# EAGLE design TeensyROM (EAGLE 7.7.0)
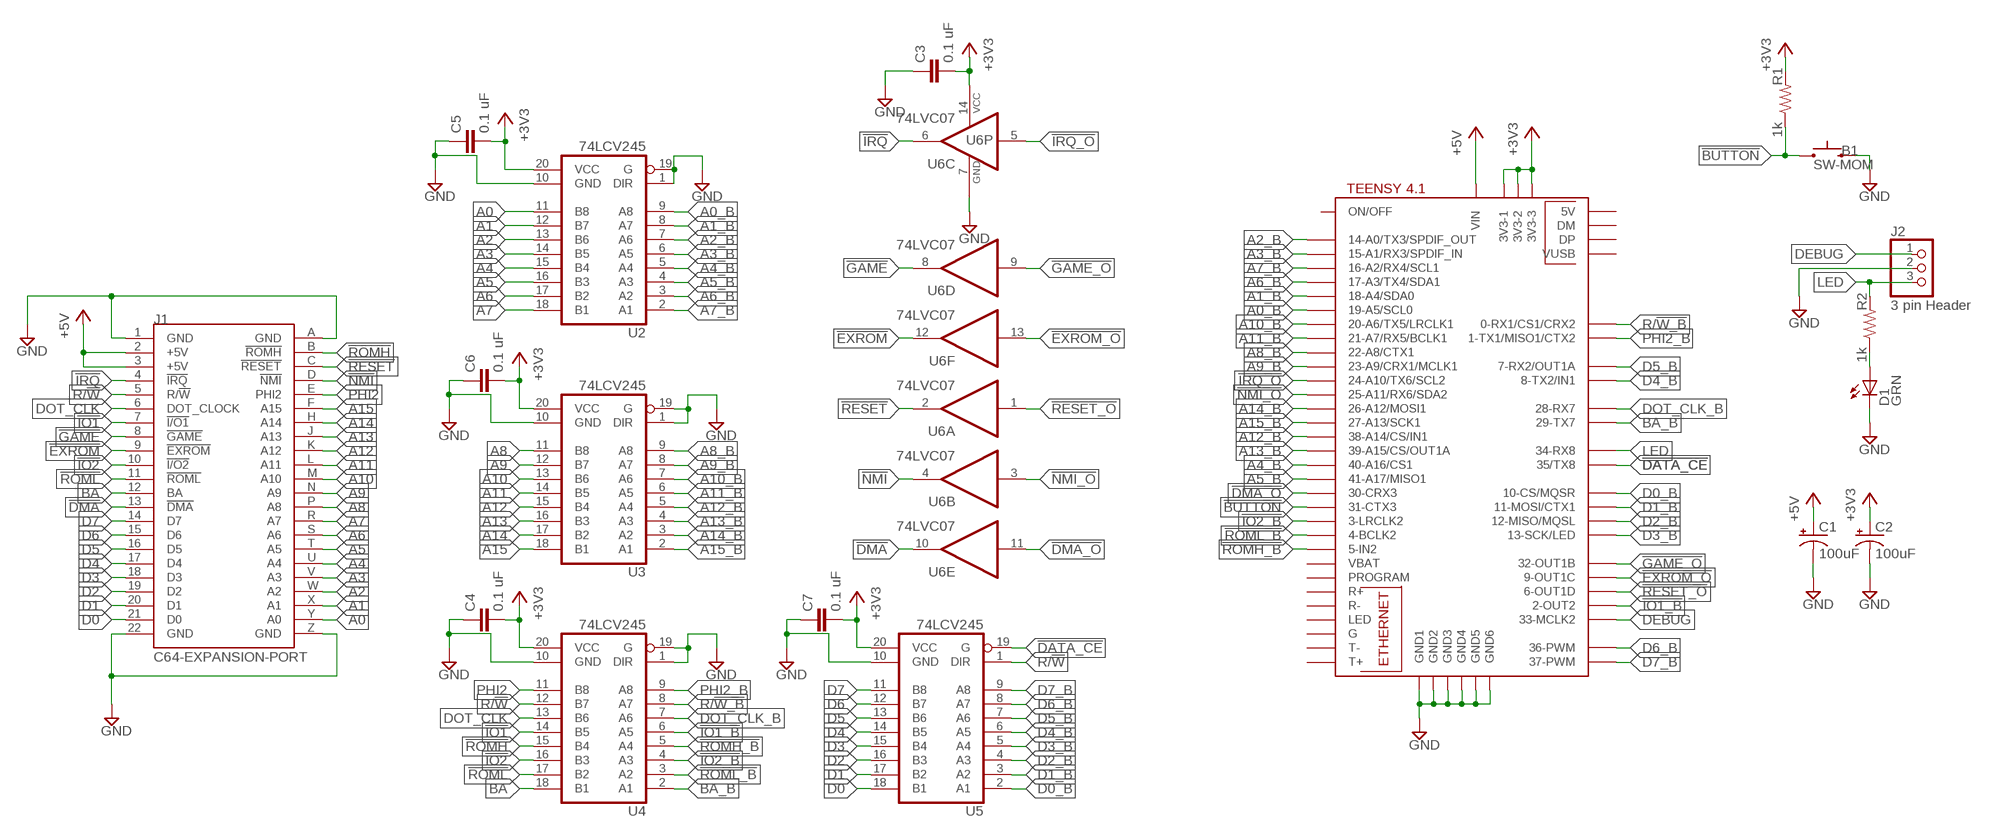
[diagram p0: schematic, sheet 1]

## Parts
B1  SW-MOM  SWITCH-MOMENTARY-2PTH  [TACTILE-PTH]
C1  100uF  CPOL-USE2.5-6  [E2,5-6]
C2  100uF  CPOL-USE2.5-6  [E2,5-6]
C3  0.1 uF  CAP-0805-0.1UF-50V  [0805]
C4  0.1 uF  CAP-0805-0.1UF-50V  [0805]
C5  0.1 uF  CAP-0805-0.1UF-50V  [0805]
C6  0.1 uF  CAP-0805-0.1UF-50V  [0805]
C7  0.1 uF  CAP-0805-0.1UF-50V  [0805]
D1  GRN  LED-3MM-GRN  [LED-3MM-PTH]
J1  C64-EXPANSION-PORT  C64-EXPANSIONPNARROW  [EXPANSIO_SQ]
J2  3 pin Header  PINHD-1X3  [1X03]
R1  1k  R-US_R0805  [R0805]
R2  1k  R-US_R0805  [R0805]
U1  TEENSY41  [TEENSY41]
U2  74LCV245  74LS245DW  [SO20W]
U3  74LCV245  74LS245DW  [SO20W]
U4  74LCV245  74LS245DW  [SO20W]
U5  74LCV245  74LS245DW  [SO20W]
U6  74LVC07  74LS07D  [SO14]

## Nets
!BUTTON: B1.1 R1.1 U1.31-CTX3
!DATA_CE: U1.35-TX8(35/TX8) U5.19(G)
!DMA: J1.13(!DMA) U6.10(E:O)
!DMA_O: U1.30-CRX3 U6.11(E:I)
!EXROM: J1.9(!EXROM) U6.12(F:O)
!EXROM_O: U1.9-OUT1C U6.13(F:I)
!GAME: J1.8(!GAME) U6.8(D:O)
!GAME_O: U1.32-OUT1B U6.9(D:I)
!IO1: J1.7(!I/O1) U4.14(B5)
!IO1_B: U1.2-OUT2 U4.6(A5)
!IO2: J1.10(!I/O2) U4.16(B3)
!IO2_B: U1.3-LRCLK2 U4.4(A3)
!IRQ: J1.4(!IRQ) U6.6(C:O)
!IRQ_O: U1.24-A10/TX6/SCL2 U6.5(C:I)
!NMI: J1.D(!NMI) U6.4(B:O)
!NMI_O: U1.25-A11/RX6/SDA2 U6.3(B:I)
!RESET: J1.C(!RESET) U6.2(A:O)
!RESET_O: U1.6-OUT1D U6.1(A:I)
!ROMH: J1.B(!ROMH) U4.15(B4)
!ROMH_B: U1.5-IN2 U4.5(A4)
!ROML: J1.11(!ROML) U4.17(B2)
!ROML_B: U1.4-BCLK2 U4.3(A2)
+3V3: C2.+ C3.2 C4.2 C5.2 C6.2 C7.2 R1.2 U1.3V3-1 U1.3V3-2 U1.3V3-3 U2.20(VCC) U3.20(VCC) U4.20(VCC) U5.20(VCC) U6.14(P:VCC)
+5V: C1.+ J1.2(+5V) J1.3(+5V) U1.VIN
A0: J1.Y(A0) U2.11(B8)
A0_B: U1.19-A5/SCL0 U2.9(A8)
A1: J1.X(A1) U2.12(B7)
A1_B: U1.18-A4/SDA0 U2.8(A7)
A2: J1.W(A2) U2.13(B6)
A2_B: U1.14-A0/TX3/SPDIF_OUT U2.7(A6)
A3: J1.V(A3) U2.14(B5)
A3_B: U1.15-A1/RX3/SPDIF_IN U2.6(A5)
A4: J1.U(A4) U2.15(B4)
A4_B: U1.40-A16/CS1 U2.5(A4)
A5: J1.T(A5) U2.16(B3)
A5_B: U1.41-A17/MISO1 U2.4(A3)
A6: J1.S(A6) U2.17(B2)
A6_B: U1.17-A3/TX4/SDA1 U2.3(A2)
A7: J1.R(A7) U2.18(B1)
A7_B: U1.16-A2/RX4/SCL1 U2.2(A1)
A8: J1.P(A8) U3.11(B8)
A8_B: U1.22-A8/CTX1 U3.9(A8)
A9: J1.N(A9) U3.12(B7)
A9_B: U1.23-A9/CRX1/MCLK1 U3.8(A7)
A10: J1.M(A10) U3.13(B6)
A10_B: U1.20-A6/TX5/LRCLK1 U3.7(A6)
A11: J1.L(A11) U3.14(B5)
A11_B: U1.21-A7/RX5/BCLK1 U3.6(A5)
A12: J1.K(A12) U3.15(B4)
A12_B: U1.38-A14/CS/IN1 U3.5(A4)
A13: J1.J(A13) U3.16(B3)
A13_B: U1.39-A15/CS/OUT1A U3.4(A3)
A14: J1.H(A14) U3.17(B2)
A14_B: U1.26-A12/MOSI1 U3.3(A2)
A15: J1.F(A15) U3.18(B1)
A15_B: U1.27-A13/SCK1 U3.2(A1)
BA: J1.12(BA) U4.18(B1)
BA_B: U1.29-TX7 U4.2(A1)
D0: J1.21(D0) U5.18(B1)
D0_B: U1.10-CS\MQSR(10-CS/MQSR) U5.2(A1)
D1: J1.20(D1) U5.17(B2)
D1_B: U1.11-MOSI/CTX1 U5.3(A2)
D2: J1.19(D2) U5.16(B3)
D2_B: U1.12-MISO/MQSL U5.4(A3)
D3: J1.18(D3) U5.15(B4)
D3_B: U1.13-SCK/LED U5.5(A4)
D4: J1.17(D4) U5.14(B5)
D4_B: U1.8-TX2/IN1 U5.6(A5)
D5: J1.16(D5) U5.13(B6)
D5_B: U1.7-RX2/OUT1A U5.7(A6)
D6: J1.15(D6) U5.12(B7)
D6_B: U1.36-PWM U5.8(A7)
D7: J1.14(D7) U5.11(B8)
D7_B: U1.37-PWM U5.9(A8)
DEBUG: J2.1 U1.33-MCLK2
DOT_CLK: J1.6(DOT_CLOCK) U4.13(B6)
DOT_CLK_B: U1.28-RX7 U4.7(A6)
GND: B1.3 C1.- C2.- C3.1 C4.1 C5.1 C6.1 C7.1 D1.K(C) J1.1(GND) J1.22(GND) J1.A(GND) J1.Z(GND) J2.2 U1.GND1 U1.GND2 U1.GND3 U1.GND4 U1.GND5 U1.GND6 U2.1(DIR) U2.10(GND) U2.19(G) U3.1(DIR) U3.10(GND) U3.19(G) U4.1(DIR) U4.10(GND) U4.19(G) U5.10(GND) U6.7(P:GND)
LED: J2.3 R2.2 U1.34-RX8
N$1: D1.A R2.1
PHI2: J1.E(PHI2) U4.11(B8)
PHI2_B: U1.1-TX1/MISO1/CTX2 U4.9(A8)
R/!W: J1.5(R/!W) U4.12(B7) U5.1(DIR)
R/!W_B: U1.0-RX1/CS1/CRX2 U4.8(A7)
Unconnected: U1.+5V(5V) U1.DM U1.DP U1.G U1.LED U1.ON/OFF U1.PROGRAM U1.R+ U1.R- U1.T+ U1.T- U1.VBAT U1.VUSB

## Library data of the parts
B1 = AudioLooper:SWITCH-MOMENTARY-2
C1 C2 = rcl:CPOL-US: POLARIZED CAPACITOR, American symbol
C3-C7 = cap:CAP-0805-: Cap, 0805; DIGIKEY: 478-10836-2-ND; MANUF1: AVX Corporation; MANUF2: Matsushita; MPN1: 08055C104KAT4A; MPN2: NMC0805X7R104K50TRPF
D1 = Dolphin v3.20:LED-3MM-: LED 3.1MM PTH; DIGIKEY: 516-1293-ND; MANUF1: Broadcom Limited; MPN1: HLMP-1503
J1 = TeensyROM:C64-EXPANSIONP
J2 = TeensyROM:PINHD-1X3: PIN HEADER
R1 R2 = resistor:R-US_: RESISTOR, American symbol
U1 = TeensyROM:TEENSY41
U2-U5 = TeensyROM:74*245: Octal BUS TRANSCEIVER, 3-state
U6 = TeensyROM:74*07: Hex BUFFER, open collector high-voltage output

## Net classes
1 vcc: width 0.254 mm

## Board
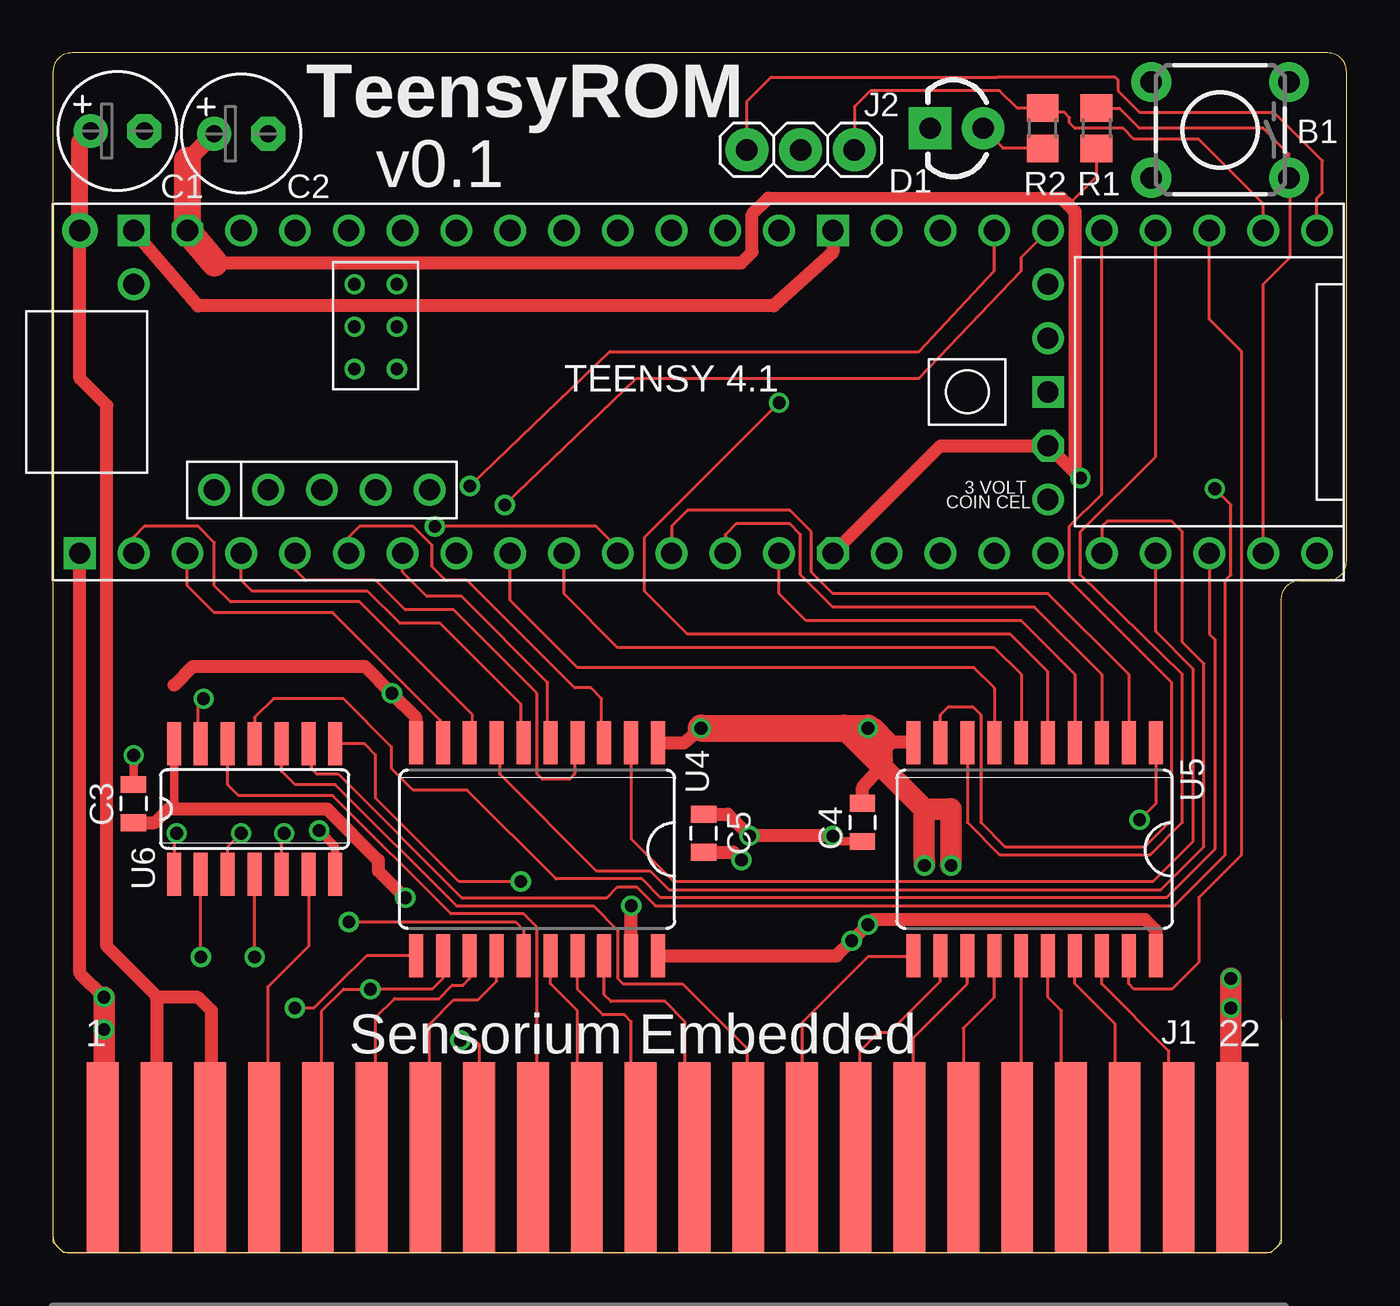
[diagram p1: board, top side]
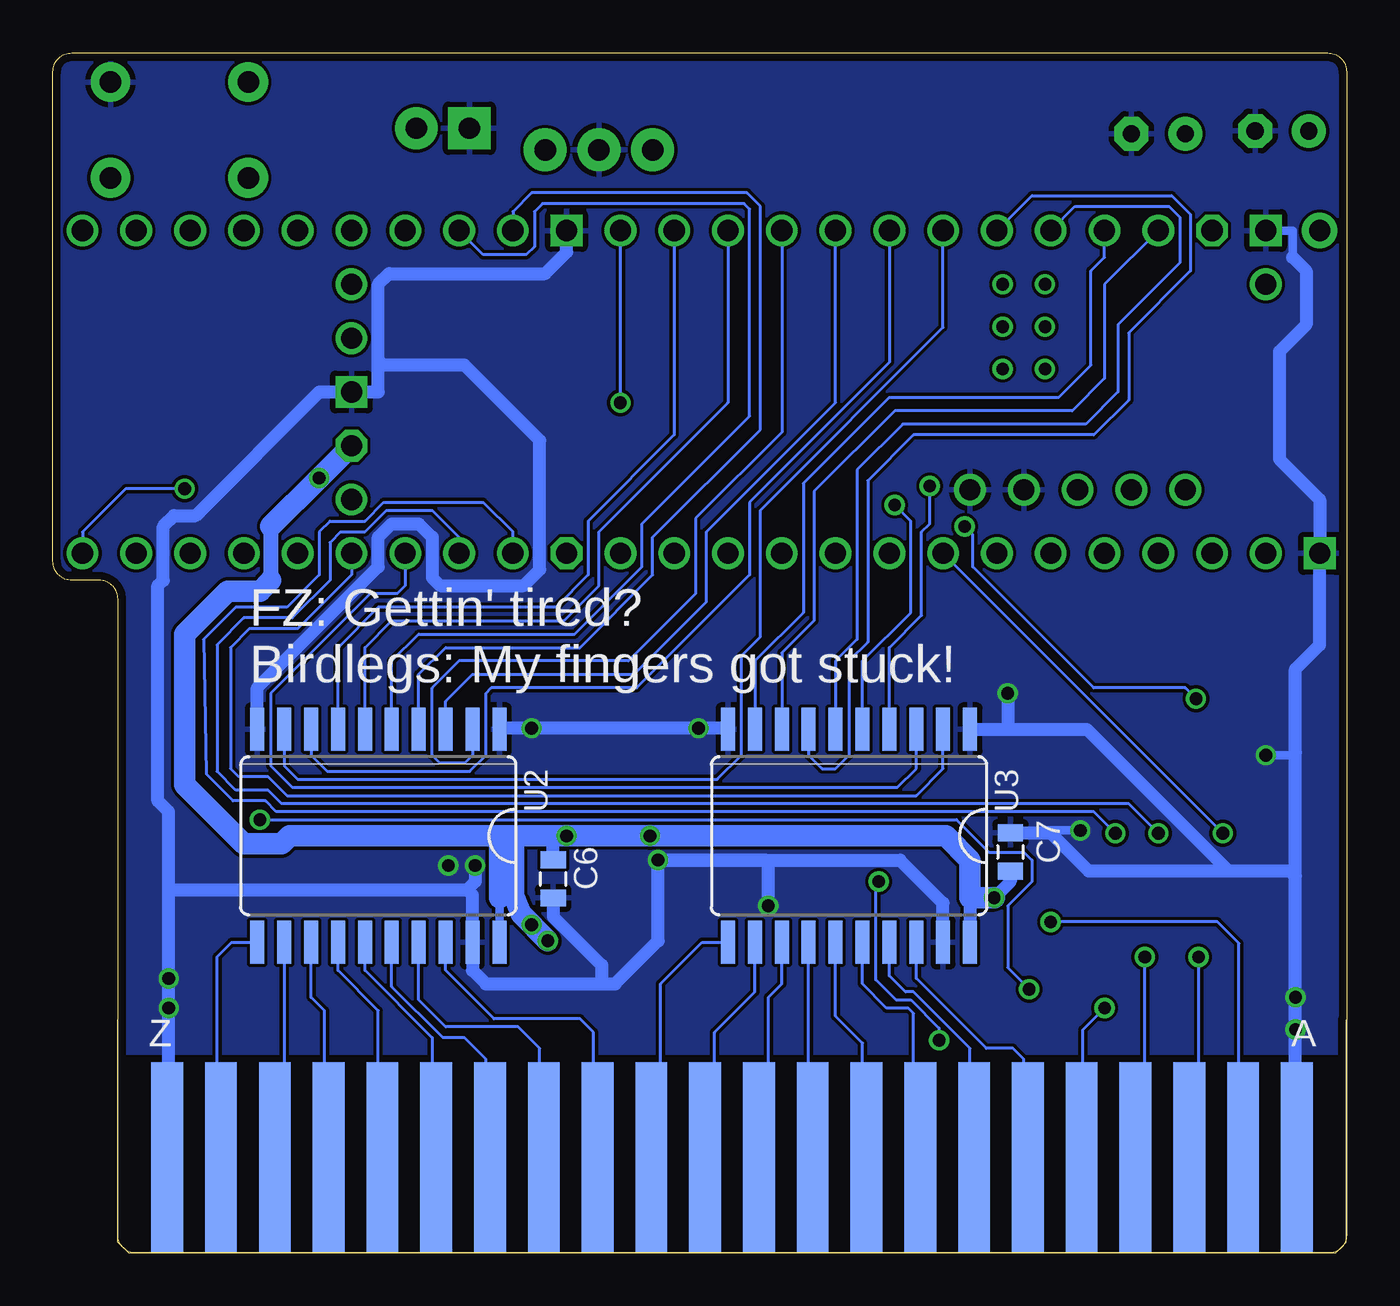
[diagram p2: board, bottom side, seen from below]

Size 61.09 x 56.64 mm. Coordinates in mm from the lower left corner, seen from the top.
Outline: 60.2,56.64 0.89,56.64 arc90 0,55.75 0,0.83 arc90 0.83,0 57.19,0 arc90 58.01,0.83 58.01,30.86 arc-90 58.9,31.75 60.2,31.75 arc90 61.09,32.64 61.09,55.75 arc90 60.2,56.64
Copper layers (1*16): Top 0.0356mm / dielectric 1.5011mm / Bottom 0.0356mm
Design rules "oshpark-2layer *": minimum track width 6mil, minimum drill 13mil, track to track 6mil, track to pad 6mil, pad to pad 6mil, via to via 6mil, smd to smd 6mil, copper to edge 15mil, drill to drill 6mil, minimum pad ring 7mil, minimum via ring 7mil, stop-mask expansion 2.5mil, vias tented up to drill 24mil, thermal gap 10mil

### Footprints (pad centres in the part's own frame; a part is rotated, then mirrored left to right if it is on the bottom)
TACTILE-PTH = drill 1.016 pad 1.88: 1 -3.251,2.261; 2 3.251,2.261; 3 -3.251,-2.261; 4 3.251,-2.261
E2,5-6 = drill 0.813 pad 1.6: + -1.27,0 | drill 0.813 pad 1.6 octagon: - 1.27,0
0805 = smd 0.8 x 1.2: 1 -0.9,0; 2 0.9,0
LED-3MM-PTH = drill 1 pad 2: A -1.25,0 | drill 1 pad 2 square: K 1.25,0
EXPANSIO_SQ = smd 1.5 x 9: 1 26.67,-4.5; 2 24.13,-4.5; 3 21.59,-4.5; 4 19.05,-4.5; 5 16.51,-4.5; 6 13.97,-4.5; 7 11.43,-4.5; 8 8.89,-4.5; 9 6.35,-4.5; 10 3.81,-4.5; 11 1.27,-4.5; 12 -1.27,-4.5; 13 -3.81,-4.5; 14 -6.35,-4.5; 15 -8.89,-4.5; 16 -11.43,-4.5; 17 -13.97,-4.5; 18 -16.51,-4.5; 19 -19.05,-4.5; 20 -21.59,-4.5; 21 -24.13,-4.5; 22 -26.67,-4.5 | smd 1.5 x 9 bottom: A 26.67,-4.5; B 24.13,-4.5; C 21.59,-4.5; D 19.05,-4.5; E 16.51,-4.5; F 13.97,-4.5; H 11.43,-4.5; J 8.89,-4.5; K 6.35,-4.5; L 3.81,-4.5; M 1.27,-4.5; N -1.27,-4.5; P -3.81,-4.5; R -6.35,-4.5; S -8.89,-4.5; T -11.43,-4.5; U -13.97,-4.5; V -16.51,-4.5; W -19.05,-4.5; X -21.59,-4.5; Y -24.13,-4.5; Z -26.67,-4.5
1X03 = drill 1.016 pad 2.032: 1 -2.54,0; 2 0,0; 3 2.54,0
R0805 = smd 1.3 x 1.5: 1 -0.95,0; 2 0.95,0
TEENSY41 = drill 1: 0-RX1/CS1/CRX2 -27.94,-7.62; 1-TX1/MISO1/CTX2 -25.4,-7.62; 2-OUT2 -22.86,-7.62; 3-LRCLK2 -20.32,-7.62; 4-BCLK2 -17.78,-7.62; 5-IN2 -15.24,-7.62; 6-OUT1D -12.7,-7.62; 7-RX2/OUT1A -10.16,-7.62; 8-TX2/IN1 -7.62,-7.62; 9-OUT1C -5.08,-7.62; 10-CS\MQSR -2.54,-7.62; 11-MOSI/CTX1 0,-7.62; 12-MISO/MQSL 2.54,-7.62; 13-SCK/LED 2.54,7.62; 14-A0/TX3/SPDIF_OUT 0,7.62; 15-A1/RX3/SPDIF_IN -2.54,7.62; 16-A2/RX4/SCL1 -5.08,7.62; 17-A3/TX4/SDA1 -7.62,7.62; 18-A4/SDA0 -10.16,7.62; 19-A5/SCL0 -12.7,7.62; 20-A6/TX5/LRCLK1 -15.24,7.62; 21-A7/RX5/BCLK1 -17.78,7.62; 22-A8/CTX1 -20.32,7.62; 23-A9/CRX1/MCLK1 -22.86,7.62; 24-A10/TX6/SCL2 7.62,-7.62; 25-A11/RX6/SDA2 10.16,-7.62; 26-A12/MOSI1 12.7,-7.62; 27-A13/SCK1 15.24,-7.62; 28-RX7 17.78,-7.62; 29-TX7 20.32,-7.62; 30-CRX3 22.86,-7.62; 31-CTX3 25.4,-7.62; 32-OUT1B 27.94,-7.62; 33-MCLK2 27.94,7.62; 34-RX8 25.4,7.62; 35-TX8 22.86,7.62; 36-PWM 20.32,7.62; 37-PWM 17.78,7.62; 38-A14/CS/IN1 15.24,7.62; 39-A15/CS/OUT1A 12.7,7.62; 40-A16/CS1 10.16,7.62; 41-A17/MISO1 7.62,7.62; +5V -24.13,-4.62; DM -21.59,-4.62; DP -19.05,-4.62; GND4 -16.51,-4.62; GND5 -13.97,-4.62; ON/OFF 15.24,5.08; PROGRAM 15.24,2.54; VBAT 15.24,-5.08; VUSB -27.94,5.08 | drill 1 octagon: 3V3-1 5.08,-7.62; 3V3-2 15.24,-2.54; 3V3-3 -25.4,7.62 | drill 0.6: G -15.51,3.08; LED -17.51,3.08; R+ -17.51,5.08; R- -15.51,5.08; T+ -15.51,1.08; T- -17.51,1.08 | drill 1 square: GND1 -30.48,-7.62; GND2 15.24,0; GND3 5.08,7.62; GND6 -27.94,7.62 | drill 1 pad 1.676: VIN -30.48,7.62
SO20W = smd 0.66 x 2.032: 1 -5.715,-5.029; 2 -4.445,-5.029; 3 -3.175,-5.029; 4 -1.905,-5.029; 5 -0.635,-5.029; 6 0.635,-5.029; 7 1.905,-5.029; 8 3.175,-5.029; 9 4.445,-5.029; 10 5.715,-5.029; 11 5.715,5.029; 12 4.445,5.029; 13 3.175,5.029; 14 1.905,5.029; 15 0.635,5.029; 16 -0.635,5.029; 17 -1.905,5.029; 18 -3.175,5.029; 19 -4.445,5.029; 20 -5.715,5.029
SO14 = smd 0.66 x 2.032: 1 -3.81,-3.073; 2 -2.54,-3.073; 3 -1.27,-3.073; 4 0,-3.073; 5 1.27,-3.073; 6 2.54,-3.073; 7 3.81,-3.073; 8 3.81,3.073; 9 2.54,3.073; 10 1.27,3.073; 11 0,3.073; 12 -1.27,3.073; 13 -2.54,3.073; 14 -3.81,3.073

### Placement (x,y rotation side)
B1  55.12,53.01 180 top
C1  3.05,52.96 0 top
C2  8.89,52.83 0 top
C3  3.81,21.21 270 top
C4  38.23,20.32 270 top
C5  30.73,19.81 90 top
C6  37.47,17.65 90 bottom
C7  15.88,18.92 270 bottom
D1  42.67,53.09 180 top
J1  29.02,0 180 top
J2  35.31,52.07 0 top
R1  49.28,53.09 270 top
R2  46.74,53.09 90 top
U1  31.75,40.64 0 top
U2  45.72,19.68 180 bottom
U3  23.5,19.68 180 bottom
U4  22.86,19.05 180 top
U5  46.35,19.05 180 top
U6  9.53,20.95 0 top

### Tracks (layer width: path | path; a pad name or v marks a point on that pad's centre or on a via)
!BUTTON
  Top 0.152: U1.31-CTX3 57.15,45.72 58.42,46.99 58.42,50.77 B1.1 58.37,51.87 57.15,53.09 51.31,53.09 50.36,54.04 R1.1
!DATA_CE
  Top 0.152: U1.35-TX8 54.61,44.07 56.13,42.55 56.13,18.8 54.1,16.76 54.1,13.72 52.83,12.45 51.05,12.45 50.8,12.7 U5.19
!DMA
  Top 0.152: J1.13 33.02,6.6 32.77,6.85 32.77,9.65 29.72,12.7 26.92,12.7 26.67,12.95 26.67,15.24 25.53,16.38 19.05,16.38 13.34,22.1 11.43,22.1 10.79,22.73 U6.10
!DMA_O
  Top 0.152: U1.30-CRX3 54.61,29.21 54.86,28.96 54.86,19.05 52.58,16.76 28.7,16.76 27.81,17.65 23.75,17.65 19.56,21.84 17.02,21.84 16,22.86 16,23.88 13.72,26.16 10.41,26.16 9.53,25.27 U6.11
!EXROM
  Top 0.152: J1.9 22.86,6.6 22.86,15.37 22.23,16 18.8,16 13.21,21.59 8.76,21.59 8.26,22.1 U6.12
!EXROM_O  (via drill 0.6)
  Top 0.152: 7.11,24.16 U6.13 6.86,24.16 6.86,25.91 v7.11,26.16 | U1.9-OUT1C 26.67,33.27 25.65,34.29 v18.03,34.29
  Bottom 0.152: v7.11,26.16 7.62,26.67 11.94,26.67 17.65,32.38 17.65,33.91 v18.03,34.29
!GAME  (via drill 0.6)
  Top 0.152: v19.24,10.03 19.94,10.03 20.13,9.84 J1.8 | v22.1,17.53 19.18,17.53 15.24,21.46 15.24,23.5 14.71,24.03 U6.8
  Bottom 0.152: v22.1,17.53 22.23,17.14 22.23,12.89 21.27,11.94 20.57,11.94 19.24,10.6 v19.24,10.03
!GAME_O  (via drill 0.6)
  Top 0.152: U6.9 12.19,23.9 12.19,22.86 12.45,22.61 13.46,22.61 19.3,16.76 26.16,16.76 26.67,17.27 27.56,17.27 28.45,16.38 52.96,16.38 55.37,18.8 55.37,31.75 55.63,32 55.63,35.31 v54.86,36.07
  Bottom 0.152: v54.86,36.07 57.66,36.07 59.69,34.04 U1.32-OUT1B
!IO1
  Top 0.152: J1.7 17.78,6.6 17.78,10.79 18.92,11.94 20.07,11.94 20.95,12.83 U4.14
!IO1_B
  Top 0.152: U4.6 22.1,24.21 22.1,25.91 18.29,29.72 16.38,29.72 14.86,31.24 9.4,31.24 8.89,31.75 U1.2-OUT2
!IO2
  Top 0.152: J1.10 24.77,6.85 24.77,11.43 23.5,12.7 U4.16
!IO2_B
  Top 0.152: U4.4 24.64,23.95 24.64,22.61 24.38,22.35 23.11,22.35 22.86,22.61 22.86,26.42 18.92,30.35 16.64,30.35 15.24,31.75 11.94,31.75 11.43,32.26 U1.3-LRCLK2
!IRQ
  Top 0.152: J1.4 10.16,6.6 10.16,12.57 12.06,14.48 U6.6
!IRQ_O  (via drill 0.6)
  Top 0.152: U6.5 10.79,19.68 v10.92,19.81
  Bottom 0.152: U1.24-A10/TX6/SCL2 39.37,34.04 40.77,35.43 45.47,35.43 46.35,34.54 48.01,34.54 48.51,34.04 48.51,32 50.04,30.48 52.45,30.48 53.98,28.96 53.85,22.61 52.58,21.34 51.05,21.34 50.55,20.83 11.94,20.83 v10.92,19.81
!NMI  (via drill 0.6)
  Top 0.152: v9.53,13.97 U6.4
  Bottom 0.152: J1.D 9.53,6.85 v9.53,13.97
!NMI_O  (via drill 0.6)
  Top 0.152: U6.3 8.26,19.18 v8.89,19.81
  Bottom 0.152: U1.25-A11/RX6/SDA2 41.91,33.78 43.18,35.05 45.34,35.05 46.35,34.04 47.5,34.04 48.01,33.53 48.01,31.75 49.78,29.97 52.07,29.97 53.34,28.7 53.34,22.73 52.45,21.84 50.93,21.84 50.29,21.21 10.29,21.21 v8.89,19.81
!RESET  (via drill 0.6)
  Top 0.152: v6.99,13.97 U6.2
  Bottom 0.152: J1.C 6.99,6.85 v6.99,13.97
!RESET_O  (via drill 0.6)
  Top 0.152: v5.84,19.81 5.71,19.68 U6.1
  Bottom 0.152: U1.6-OUT1D v5.84,19.81
!ROMH  (via drill 0.6)
  Top 0.152: v13.97,15.62 21.84,15.62 22.23,15.24 U4.15
  Bottom 0.152: v13.97,15.62 6.1,15.62 5.08,14.61 5.08,8.89 4.89,8.7 J1.B
!ROMH_B
  Top 0.152: U4.5 23.37,24.21 23.37,26.92 19.3,30.99 17.65,30.99 16.51,32.13 U1.5-IN2
!ROML
  Top 0.152: J1.11 27.3,6.85 27.3,10.92 26.99,11.24 25.97,11.24 24.77,12.45 U4.17
!ROML_B
  Top 0.152: U4.3 25.91,24.21 25.91,26.16 25.4,26.67 24.64,26.67 19.56,31.75 18.54,31.75 17.91,32.38 17.91,33.4 17.02,34.29 14.48,34.29 13.97,33.78 U1.4-BCLK2
+3V3  (via drill 0.6)
  Top 0.152: R1.2 49.28,50.8 47.94,49.47
  Top 0.406: C4.2 37.09,19.42 v36.83,19.68 | U6.14 5.71,21.08 5.84,20.95
  Top 0.61: 7.62,46.74 32.51,46.74 33.02,47.24 33.02,49.02 33.78,49.78 47.62,49.78 47.94,49.47 48.26,49.15 48.26,36.83 v48.51,36.58 U1.3V3-2 41.91,38.1 U1.3V3-1 | 6.35,49.4 U1.3V3-3 | U4.20 37.01,14.02 v37.72,14.73 v38.48,15.49 38.73,15.75 51.56,15.75 52.07,15.24 U5.20 | v16.64,16.76 15.37,18.03 15.37,18.54 12.95,20.95 5.84,20.95 5.46,20.95 4.82,20.31 C3.2 | C5.2 31.87,20.71 v32.89,19.68 v36.83,19.68
  Top 0.813: C2.+ 6.35,51.56
  Top 1.27: 7.62,46.74 U1.3V3-3 6.35,51.56
  Bottom 0.406: U2.20 40.01,16.76
  Bottom 0.61: 47.37,38.1 U1.3V3-2 | 17.78,16.76 U3.20 | C7.2 15.88,17.53 v16.64,16.76 | C6.2 37.47,19.68
  Bottom 0.711: 50.8,34.29 50.8,31.75
  Bottom 0.813: 38.99,19.56 39.37,19.3 39.24,19.18 39.24,16.64 39.88,17.27 40.01,17.27
  Bottom 1.016: U1.3V3-2 v48.51,36.58 50.8,34.29 | 40.01,16.76 40.01,17.27 40.01,19.68 | 40.01,19.68 37.47,19.68 v32.89,19.68 18.92,19.68 17.78,18.54 17.78,16.76 v16.64,16.76 | 40.01,19.68 49.91,19.68 50.29,19.3 52.07,19.3 54.86,22.1 54.86,29.21 52.83,31.24 51.31,31.24 50.8,31.75 | 39.24,16.64 38.99,16 v37.72,14.73
+5V
  Top 0.61: J1.3 7.49,6.47 7.49,11.43 6.86,12.06 4.95,12.06 | 4.95,12.06 4.89,12 J1.2 | 4.95,12.06 2.54,14.48 2.54,40.01 1.27,41.27 U1.VIN
  Top 0.813: U1.VIN 1.27,52.45 C1.+
A0
  Bottom 0.152: J1.Y 53.34,6.6 53.34,13.97 52.65,14.66 U2.11
A0_B
  Bottom 0.152: U2.9 50.16,22.99 49.53,22.35 29.72,22.35 28.57,23.5 28.57,28.19 27.69,29.08 27.69,35.05 19.05,43.69 U1.19-A5/SCL0
A1
  Bottom 0.152: J1.X 50.16,6.85 U2.12
A1_B
  Bottom 0.152: U1.18-A4/SDA0 21.59,42.04 28.19,35.43 28.19,32 33.53,26.67 40.39,26.67 40.64,26.42 40.64,23.5 41.4,22.73 48.13,22.73 48.9,23.5 U2.8
A2
  Bottom 0.152: J1.W 48.26,6.6 48.26,11.43 48.9,12.06 U2.13
A2_B
  Bottom 0.152: U1.14-A0/TX3/SPDIF_OUT 31.75,38.61 35.81,34.54 35.81,32 37.34,30.48 45.72,30.48 47.62,28.57 U2.7
A3
  Bottom 0.152: J1.V 45.72,6.6 45.72,11.43 47.62,13.34 U2.14
A3_B
  Bottom 0.152: U2.6 46.35,28.57 45.09,29.84 36.96,29.84 35.31,31.5 35.31,34.04 29.21,40.13 U1.15-A1/RX3/SPDIF_IN
A4
  Bottom 0.152: J1.U 43.16,6.4 | 43.16,6.4 43.18,6.6 | U2.15 46.35,13.34 43.18,10.16 43.18,6.42 43.16,6.4
A4_B
  Bottom 0.152: U2.5 45.09,27.94 43.81,29.21 36.45,29.21 33.27,32.38 33.27,34.42 28.19,39.5 28.19,49.28 28.45,49.53 37.97,49.53 38.35,49.15 38.35,47.5 38.73,47.12 40.77,47.12 U1.40-A16/CS1
A5
  Bottom 0.152: J1.T 40.64,6.6 40.64,9.14 41.66,10.16 42.67,10.16 45.09,12.57 U2.16
A5_B
  Bottom 0.152: U2.4 43.81,27.3 42.55,28.57 36.2,28.57 32.77,32 32.77,33.78 27.69,38.86 27.69,49.4 28.32,50.04 38.48,50.04 39.37,49.15 U1.41-A17/MISO1
A6
  Bottom 0.152: J1.S 38.1,6.6 38.1,9.65 39.12,10.67 42.55,10.67 43.81,11.94 U2.17
A6_B
  Bottom 0.152: U2.3 42.55,26.04 41.27,27.3 33.66,27.3 30.23,30.73 30.23,34.04 24.13,40.13 U1.17-A3/TX4/SDA1
A7
  Bottom 0.152: J1.R 35.56,6.6 35.56,10.41 36.2,11.05 40.26,11.05 42.55,13.34 U2.18
A7_B
  Bottom 0.152: U2.2 41.27,23.5 41.66,23.11 42.8,23.11 43.18,23.5 43.18,26.67 41.91,27.94 33.91,27.94 30.73,31.11 30.73,34.67 26.67,38.73 U1.16-A2/RX4/SCL1
A8
  Bottom 0.152: J1.P 32.38,6.85 32.38,12.7 30.43,14.66 U3.11
A8_B
  Bottom 0.152: U1.22-A8/CTX1 11.43,46.99 12.06,46.35 12.06,41.91 13.59,40.39 21.59,40.39 25.65,36.32 25.65,30.23 27.94,27.94 U3.9
A9
  Bottom 0.152: J1.N 29.84,6.85 29.84,10.41 27.94,12.32 U3.12
A9_B
  Bottom 0.152: U1.23-A9/CRX1/MCLK1 11.43,45.72 11.43,41.27 12.95,39.75 21.34,39.75 25.15,35.94 25.15,29.84 26.67,28.32 U3.8
A10
  Bottom 0.152: J1.M 27.3,6.85 27.3,12.06 26.67,12.7 U3.13
A10_B
  Bottom 0.152: U1.20-A6/TX5/LRCLK1 14.86,49.91 8.26,49.91 7.37,49.02 7.37,46.35 10.29,43.43 10.29,40.26 11.94,38.61 20.45,38.61 22.61,36.45 22.61,28.83 23.5,27.94 23.5,23.5 24.13,22.86 24.77,22.86 25.4,23.5 U3.7
A11
  Bottom 0.152: J1.L 25.4,6.6 U3.14
A11_B
  Bottom 0.152: U1.21-A7/RX5/BCLK1 12.83,49.4 8.38,49.4 7.87,48.9 7.87,46.74 10.79,43.81 10.79,40.64 12.32,39.12 20.95,39.12 23.11,36.96 23.11,28.96 24.13,27.94 U3.6
A12
  Bottom 0.152: J1.K 22.86,6.6 22.86,9.91 24.13,11.18 U3.15
A12_B  (via drill 0.6)
  Top 0.152: v21.34,35.31 27.56,41.27 40.89,41.27 45.72,46.35 45.72,46.99 U1.38-A14/CS/IN1
  Bottom 0.152: U3.5 22.86,27.94 20.57,30.23 20.57,34.54 v21.34,35.31
A13
  Bottom 0.152: J1.J 20.45,6.72 20.45,11.3 20.7,11.56 21.72,11.56 22.86,12.7 U3.16
A13_B  (via drill 0.6)
  Top 0.152: v19.68,36.2 26.29,42.55 40.89,42.55 44.45,46.35 U1.39-A15/CS/OUT1A
  Bottom 0.152: U3.4 21.59,28.57 20.07,30.1 20.07,34.04 19.68,34.42 v19.68,36.2
A14
  Bottom 0.152: J1.H 17.78,6.6 17.78,9.65 20.45,12.32 20.83,12.32 21.59,13.08 U3.17
A14_B
  Bottom 0.152: U1.26-A12/MOSI1 44.45,31.5 44.83,31.11 46.1,31.11 50.8,26.42 50.8,22.99 49.78,21.97 21.21,21.97 20.32,22.86 U3.3
A15
  Bottom 0.152: J1.F 15.24,6.6 15.24,9.14 15.75,9.65 17.02,9.65 20.32,12.95 U3.18
A15_B
  Bottom 0.152: U1.27-A13/SCK1 46.99,32 49.53,29.46 51.82,29.46 52.7,28.57 52.7,22.86 52.32,22.48 50.93,22.48 50.04,21.59 20.32,21.59 19.05,22.86 U3.2
BA
  Top 0.152: J1.12 29.84,6.85 29.84,10.92 28.89,11.87 26.35,11.87 26.04,12.19 U4.18
BA_B
  Top 0.152: U4.2 27.3,19.56 29.34,17.53 51.94,17.53 53.85,19.43 53.85,27.56 52.07,29.34 U1.29-TX7
D0
  Top 0.152: J1.21 52.7,6.85 52.7,9.53 49.53,12.7 U5.18
D0_B
  Top 0.152: U1.10-CS\MQSR 29.21,34.29 29.97,35.05 34.8,35.05 35.81,34.04 35.81,32.13 36.83,31.11 46.99,31.11 50.8,27.3 U5.2
D1
  Top 0.152: J1.20 50.16,6.85 50.16,10.79 48.26,12.7 U5.17
D1_B
  Top 0.152: U1.11-MOSI/CTX1 31.75,33.91 32.26,34.42 34.8,34.42 35.31,33.91 35.31,32 36.83,30.48 46.35,30.48 49.53,27.3 U5.3
D2
  Top 0.152: J1.19 47.62,6.85 47.62,11.43 46.99,12.06 U5.16
D2_B
  Top 0.152: U1.12-MISO/MQSL 34.29,31.11 35.56,29.84 45.72,29.84 48.26,27.3 U5.4
D3
  Top 0.152: J1.18 45.72,6.6 U5.15
D3_B  (via drill 0.6)
  Top 0.152: U5.5 46.99,27.43 45.21,29.21 29.97,29.21 27.94,31.24 27.94,33.78 v34.29,40.13
  Bottom 0.152: v34.29,40.13 U1.13-SCK/LED
D4
  Top 0.152: J1.17 42.99,10.6 44.45,12.06 U5.14
D4_B
  Top 0.152: U1.8-TX2/IN1 24.13,31.11 26.67,28.57 44.45,28.57 45.72,27.3 U5.6
D5
  Top 0.152: J1.16 40.64,6.6 40.64,10.16 43.18,12.7 U5.13
D5_B
  Top 0.152: U1.7-RX2/OUT1A 21.59,30.8 24.77,27.62 43.5,27.62 44.45,26.67 U5.7
D6
  Top 0.152: J1.15 38.1,6.6 38.1,9.53 38.99,10.41 39.5,10.41 41.91,12.83 U5.12
D6_B
  Top 0.152: U5.8 43.18,20.32 44.7,18.8 51.82,18.8 53.34,20.32 53.34,27.3 48.51,32 48.51,34.04 52.07,37.59 U1.36-PWM
D7
  Top 0.152: J1.14 35.37,10.86 38.48,13.97 40.59,13.97 U5.11
D7_B
  Top 0.152: U5.9 41.91,25.4 42.29,25.78 43.43,25.78 43.81,25.4 43.81,20.32 44.96,19.18 51.56,19.18 52.83,20.45 52.83,26.92 48.01,31.75 48.01,34.29 49.53,35.81 U1.37-PWM
DEBUG
  Top 0.152: U1.33-MCLK2 59.69,49.78 59.94,50.04 59.94,51.56 57.66,53.85 51.31,53.85 50.29,54.86 50.29,55.37 50.16,55.5 45.21,55.5 44.58,55.5 33.91,55.5 32.77,54.36 J2.1
DOT_CLK
  Top 0.152: J1.6 15.24,6.6 15.24,11.11 16.13,12 18.22,12 18.86,12.64 19.37,12.64 19.68,12.95 U4.13
DOT_CLK_B
  Top 0.152: U4.7 21.08,23.95 21.08,22.61 25.65,18.03 28.19,18.03 29.08,17.14 52.32,17.14 54.36,19.18 54.36,27.81 53.34,28.83 53.34,34.04 52.83,34.54 49.78,34.54 49.53,34.29 U1.28-RX7
GND  (via drill 0.6)
  Top 0.152: 42.41,18.3 v42.42,18.29
  Top 0.406: C3.1 v3.81,23.5 | U6.7 13.34,19.18 v12.57,19.94
  Top 0.61: J1.Z 55.63,6.47 | J1.A 2.41,6.47 | v2.41,12.06 1.27,13.21 U1.GND1 | U4.1 29.79,24.08 v30.61,24.77 | v38.48,24.77 38.73,24.77 | U5.10 40.59,24.13 39.37,24.13 39.37,23.24 38.23,21.97 C4.1 | C5.1 32.12,18.91 v32.51,18.54 | U4.19 v27.3,16.38 | U4.10 17.14,25.27 v16,26.42 14.73,27.69 6.6,27.69 5.71,26.8 | U1.GND3 36.83,47.24 34.04,44.7 6.86,44.7 U1.GND6
  Top 1.016: 55.63,6.47 v55.63,12.95 | v2.41,12.06 2.41,6.47 | 37.34,24.77 41.14,20.97 41.14,18.81 v41.15,18.29 | 38.73,24.77 39.37,24.13 | 42.41,20.97 42.41,20.94 | 42.41,20.94 42.41,18.3 | 41.26,20.94 42.41,20.94
  Top 1.27: v30.61,24.77 37.34,24.77 v38.48,24.77
  Bottom 0.406: 2.54,46.99 2.54,48.26 U1.GND6 | v3.81,23.5 2.54,23.5 2.41,23.62 | v12.57,19.94 14.1,19.94
  Bottom 0.61: 55.63,17.14 v55.63,12.95 55.63,6.47 J1.Z | U3.10 29.26,24.77 v38.48,24.77 39.95,24.77 U2.1 | 45.72,42.16 45.72,40.64 U1.GND2 48.51,40.64 54.36,34.8 55.37,34.8 55.88,34.29 55.88,31.75 56.13,31.5 56.13,21.34 55.63,20.83 55.63,17.14 | 45.72,42.16 45.72,45.72 45.21,46.23 37.85,46.23 36.83,47.24 U1.GND3 | J1.A 2.41,6.47 2.41,17.78 | 2.41,17.78 2.41,23.62 2.41,27.56 1.27,28.7 U1.GND1 1.27,35.56 3.17,37.47 3.17,42.55 1.91,43.81 1.91,46.35 2.54,46.99 | 55.63,17.14 41.53,17.14 | 41.53,17.14 41.27,16.89 U2.19 41.27,13.34 40.64,12.7 35.18,12.7 | 35.18,12.7 34.54,12.7 32.51,14.73 v32.51,18.54 | v32.51,18.54 21.08,18.54 19.05,16.51 U3.19 | C7.1 13.98,19.82 12.19,18.03 5.59,18.03 | 5.59,18.03 2.67,18.03 2.41,17.78 | U3.1 16,24.71 | 16,24.71 12.27,24.71 5.59,18.03 | U2.10 51.44,26.67 45.72,32.38 45.72,33.78 45.09,34.42 43.81,34.42 43.18,33.78 43.18,31.88 42.8,31.5 38.86,31.5 38.1,32.26 38.1,38.35 41.66,41.91 45.47,41.91 45.72,42.16 | C6.1 37.47,15.88 35.18,13.59 35.18,12.7 | v27.3,16.38 27.3,18.41 27.43,18.54 v32.51,18.54 | v16,26.42 16,24.71 | v41.15,18.29 41.15,17.53 41.53,17.14
  other vias: 2.41,10.54 55.63,11.56
  pour Bottom: 0,9.4 61.72,9.4 61.72,57.15 0,57.15
LED
  Top 0.152: U1.34-RX8 57.15,49.53 54.1,52.58 51.05,52.58 50.55,53.09 48.26,53.09 48.01,53.34 48.01,53.59 47.75,53.85 46.42,53.85 R2.2 45.53,54.04 44.7,54.86 38.61,54.86 37.85,54.1 J2.3
N$1
  Top 0.152: R2.1 44.87,52.14 D1.A
PHI2  (via drill 0.6)
  Top 0.152: U4.11 14.81,14.02 13.46,12.7 12.32,11.56 v11.43,11.56
  Bottom 0.152: J1.E 12.45,6.34 12.45,10.54 v11.43,11.56
PHI2_B
  Top 0.152: U4.9 18.29,24.21 18.29,25.15 13.21,30.23 7.62,30.23 6.35,31.5 U1.1-TX1/MISO1/CTX2
R/!W  (via drill 0.6)
  Top 0.152: J1.5 12.7,6.6 12.7,11.43 13.72,12.45 v14.99,12.45 17.91,12.45 18.41,12.95 U4.12 | U5.1 52.07,21.21 v51.31,20.45
  Bottom 0.152: v51.31,20.45 18.41,20.45 16.89,18.92 15.24,18.92 14.86,18.54 14.86,17.53 16,16.38 16,13.46 v14.99,12.45
R/!W_B
  Top 0.152: U4.8 19.81,24.21 19.81,25.4 14.48,30.73 8.38,30.73 7.62,31.5 7.62,33.53 6.86,34.29 4.32,34.29 3.81,33.78 U1.0-RX1/CS1/CRX2

### Text on the board
tPlace: TeensyROM | v0.1 | Sensorium Embedded
bPlace: FZ: Gettin' tired? / Birdlegs: My fingers got stuck!